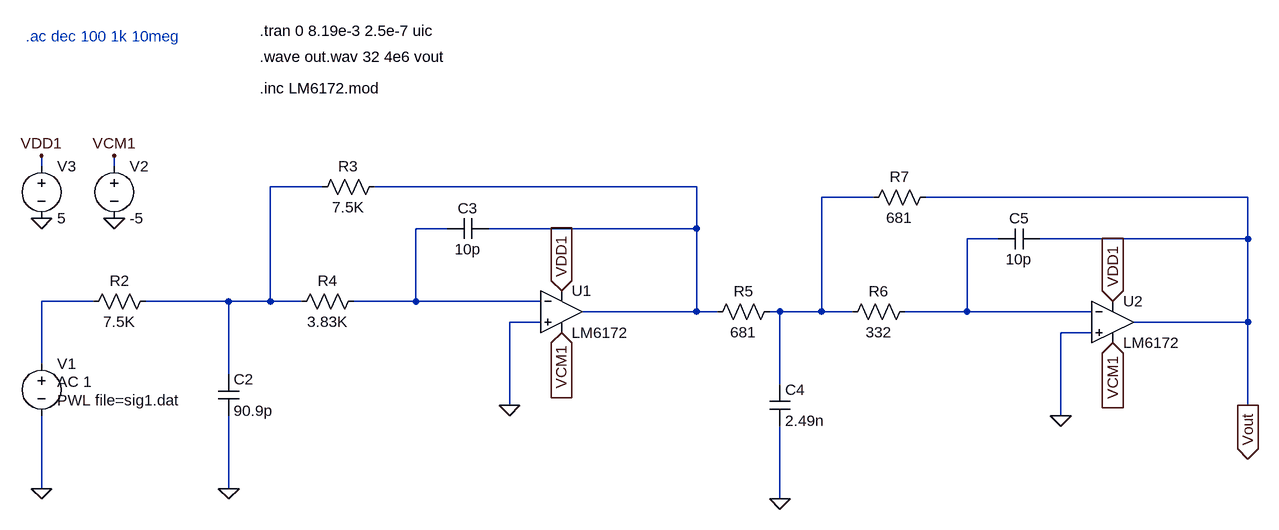
[diagram p0: schematic Xdb-223-X-2stage-4order.asc]
Xdb-223-X-2stage-4order.asc, the LTspice schematic file:
Version 4
SHEET 1 2036 680
WIRE -400 -432 -400 -448
WIRE -288 -432 -288 -448
WIRE 32 -400 -48 -400
WIRE 608 -400 112 -400
WIRE 880 -384 800 -384
WIRE 1456 -384 960 -384
WIRE 224 -336 176 -336
WIRE 608 -336 608 -400
WIRE 608 -336 288 -336
WIRE 1072 -320 1024 -320
WIRE 1456 -320 1456 -384
WIRE 1456 -320 1136 -320
WIRE -320 -224 -400 -224
WIRE -112 -224 -240 -224
WIRE -48 -224 -48 -400
WIRE -48 -224 -112 -224
WIRE 0 -224 -48 -224
WIRE 176 -224 176 -336
WIRE 176 -224 80 -224
WIRE 368 -224 176 -224
WIRE 608 -208 608 -336
WIRE 608 -208 432 -208
WIRE 640 -208 608 -208
WIRE 736 -208 720 -208
WIRE 800 -208 800 -384
WIRE 800 -208 736 -208
WIRE 848 -208 800 -208
WIRE 1024 -208 1024 -320
WIRE 1024 -208 928 -208
WIRE 1216 -208 1024 -208
WIRE 368 -192 320 -192
WIRE 1456 -192 1456 -320
WIRE 1456 -192 1280 -192
WIRE 1216 -176 1168 -176
WIRE -400 -128 -400 -224
WIRE -112 -112 -112 -224
WIRE 736 -96 736 -208
WIRE 320 -64 320 -192
WIRE 1456 -64 1456 -192
WIRE 1168 -48 1168 -176
WIRE -400 64 -400 -48
WIRE -112 64 -112 -48
WIRE 736 80 736 -32
FLAG -112 64 0
FLAG 320 -64 0
FLAG 400 -240 VDD1
IOPIN 400 -240 In
FLAG 400 -176 VCM1
IOPIN 400 -176 In
FLAG -400 -352 0
FLAG -288 -352 0
FLAG -400 -448 VDD1
FLAG -288 -448 VCM1
FLAG 736 80 0
FLAG 1168 -48 0
FLAG 1248 -224 VDD1
IOPIN 1248 -224 In
FLAG 1248 -160 VCM1
IOPIN 1248 -160 In
FLAG 1456 -64 Vout
IOPIN 1456 -64 Out
FLAG -400 64 0
SYMBOL res -224 -240 R90
WINDOW 0 0 56 VBottom 2
WINDOW 3 32 56 VTop 2
SYMATTR InstName R2
SYMATTR Value 7.5K
SYMBOL cap 288 -352 R90
WINDOW 0 0 32 VBottom 2
WINDOW 3 32 32 VTop 2
SYMATTR InstName C3
SYMATTR Value 10p
SYMBOL res 128 -416 R90
WINDOW 0 0 56 VBottom 2
WINDOW 3 32 56 VTop 2
SYMATTR InstName R3
SYMATTR Value 7.5K
SYMBOL res 96 -240 R90
WINDOW 0 0 56 VBottom 2
WINDOW 3 32 56 VTop 2
SYMATTR InstName R4
SYMATTR Value 3.83K
SYMBOL cap -128 -48 M180
WINDOW 0 24 56 Left 2
WINDOW 3 24 8 Left 2
SYMATTR InstName C2
SYMATTR Value 90.9p
SYMBOL voltage -288 -448 R0
WINDOW 123 0 0 Left 0
WINDOW 39 0 0 Left 0
SYMATTR InstName V2
SYMATTR Value -5
SYMBOL OpAmps\\opamp2 400 -272 R0
SYMATTR InstName U1
SYMATTR Value LM6172
SYMBOL voltage -400 -448 R0
WINDOW 123 0 0 Left 0
WINDOW 39 0 0 Left 0
SYMATTR InstName V3
SYMATTR Value 5
SYMBOL res 736 -224 R90
WINDOW 0 0 56 VBottom 2
WINDOW 3 32 56 VTop 2
SYMATTR InstName R5
SYMATTR Value 681
SYMBOL cap 1136 -336 R90
WINDOW 0 0 32 VBottom 2
WINDOW 3 32 32 VTop 2
SYMATTR InstName C5
SYMATTR Value 10p
SYMBOL res 976 -400 R90
WINDOW 0 0 56 VBottom 2
WINDOW 3 32 56 VTop 2
SYMATTR InstName R7
SYMATTR Value 681
SYMBOL res 944 -224 R90
WINDOW 0 0 56 VBottom 2
WINDOW 3 32 56 VTop 2
SYMATTR InstName R6
SYMATTR Value 332
SYMBOL cap 720 -32 M180
WINDOW 0 24 56 Left 2
WINDOW 3 24 8 Left 2
SYMATTR InstName C4
SYMATTR Value 2.49n
SYMBOL OpAmps\\opamp2 1248 -256 R0
SYMATTR InstName U2
SYMATTR Value LM6172
SYMBOL voltage -400 -144 R0
WINDOW 3 24 72 Left 2
WINDOW 123 24 44 Left 2
WINDOW 39 24 72 Left 2
SYMATTR Value PWL file=sig1.dat
SYMATTR Value2 AC 1
SYMATTR InstName V1
TEXT -64 -552 Left 2 !.inc LM6172.mod
TEXT -64 -640 Left 2 !.tran 0 8.19e-3 2.5e-7 uic
TEXT -64 -600 Left 2 !.wave out.wav 32 4e6 vout
TEXT -424 -632 Left 2 ;.ac dec 100 1k 10meg

The netlist it stands for:
* Xdb-223-X-2stage-4order.asc
R2 N001 N006 7.5K
C3 N002 N004 10p
R3 N002 N001 7.5K
R4 N004 N001 3.83K
C2 0 N001 90.9p
V2 VCM1 0 -5
XU1 0 N004 VDD1 VCM1 N002 LM6172  ; pins In+ In- V+ V- OUT
V3 VDD1 0 5
R5 N003 N002 681
C5 Vout N005 10p
R7 Vout N003 681
R6 N005 N003 332
C4 0 N003 2.49n
XU2 0 N005 VDD1 VCM1 Vout LM6172  ; pins In+ In- V+ V- OUT
V1 N006 0 PWL file=sig1.dat AC 1
.inc LM6172.mod
.tran 0 8.19e-3 2.5e-7 uic
.wave out.wav 32 4e6 vout
* .ac dec 100 1k 10meg
.backanno
.end